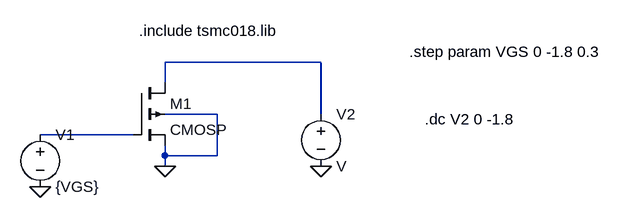
[diagram p0: schematic Exp-3 pMOS ch - ID vs VDS.asc]
Exp-3 pMOS ch - ID vs VDS.asc, the LTspice schematic file:
Version 4
SHEET 1 900 680
WIRE 448 80 208 80
WIRE 208 112 208 80
WIRE 288 160 208 160
WIRE 448 160 448 80
WIRE 160 192 16 192
WIRE 208 224 208 208
WIRE 288 224 288 160
WIRE 288 224 208 224
WIRE 208 240 208 224
FLAG 448 240 0
FLAG 16 272 0
FLAG 208 240 0
SYMBOL cmosp 160 112 R0
SYMATTR InstName M1
SYMATTR Value2 l=180n w=800n
SYMBOL voltage 16 176 R0
WINDOW 123 0 0 Left 0
WINDOW 39 0 0 Left 0
SYMATTR InstName V1
SYMATTR Value {VGS}
SYMBOL voltage 448 144 R0
SYMATTR InstName V2
TEXT 168 32 Left 2 !.include tsmc018.lib
TEXT 584 64 Left 2 !.step param VGS 0 -1.8 0.3
TEXT 608 168 Left 2 !.dc V2 0 -1.8

The netlist it stands for:
* Exp-3 pMOS ch - ID vs VDS.asc
M1 N001 N002 0 0 CMOSP l=180n w=800n
V1 N002 0 {VGS}
V2 N001 0 V
.model NMOS NMOS
.model PMOS PMOS
.lib standard.mos
.include tsmc018.lib
.step param VGS 0 -1.8 0.3
.dc V2 0 -1.8
.backanno
.end